# Altium schematic sheet Power.SchDoc
size A4
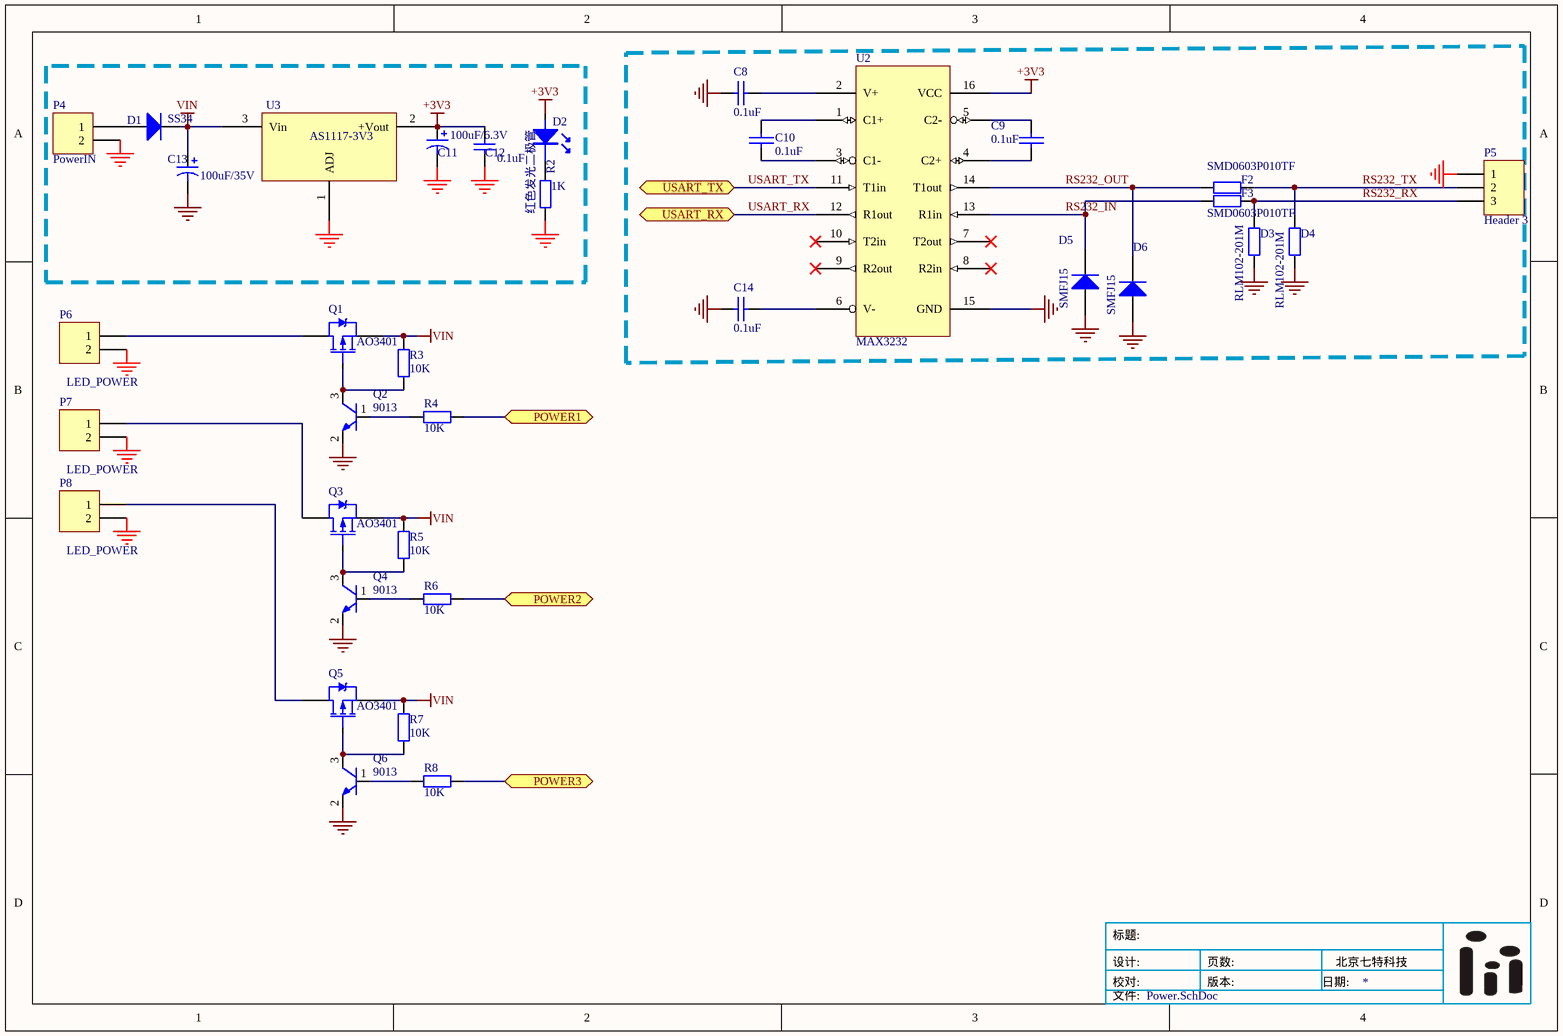
[diagram p0: Power.SchDoc]

## Parts
C8  0.1uF  [C2012]
C9  0.1uF  [C2012]
C10  0.1uF  [C2012]
C11  100uF/6.3V  [3216]
C12  0.1uF  [C2012]
C13  100uF/35V  [ECS6.3/6.6]
C14  0.1uF  [C2012]
D1  SS34  [SMA_DO-214AC]
D2  红色发光二极管  [LED/S]
D3  RLM102-201M  [RLM102]
D4  RLM102-201M  [RLM102]
D5  SMFJ15  [SOD-123]
D6  SMFJ15  [SOD-123]
F2  SMD0603P010TF  [1608]
F3  SMD0603P010TF  [1608]
P4  PowerIN  [5264-2]
P5  Header 3  [B3B-XH-A]
P6  LED_POWER  [B2B-XH-A]
P7  LED_POWER  [B2B-XH-A]
P8  LED_POWER  [B2B-XH-A]
Q1  AO3401  [SOT-23]
Q2  9013  [sot-23]
Q3  AO3401  [SOT-23]
Q4  9013  [sot-23]
Q5  AO3401  [SOT-23]
Q6  9013  [sot-23]
R2  1K  [2012]
R3  10K  [2012]
R4  10K  [2012]
R5  10K  [2012]
R6  10K  [2012]
R7  10K  [2012]
R8  10K  [2012]
U2  MAX3232  [SO16]
U3  AS1117-3V3  [SOT223_L]

## Ports
POWER1, POWER2, POWER3, USART_RX, USART_TX

## Nets
+3V3: C11.1 C12.2 D2.A U2.16(VCC) U3.2(+Vout)
GND: C8.1 C11.2 C12.1 C13.2 C14.2 D3.2 D4.2 D5.1(A) D6.1(A) P4.2 P5.1 P6.2 P7.2 P8.2 Q2.2(E) Q4.2(E) Q6.2(E) R2.2 U2.15(GND) U3.1(ADJ)
VIN: C13.1 D1.2(K) Q1.2(D) Q3.2(D) Q5.2(D) R3.2 R5.2 R7.2 U3.3(Vin)
POWER1: R4.1 ; port POWER1
POWER2: R6.1 ; port POWER2
POWER3: R8.1 ; port POWER3
RS232_IN: D5.2(K) F3.2 U2.13(R1in)
RS232_OUT: D6.2(K) F2.2 U2.14(T1out)
RS232_RX: D3.1 F3.1 P5.3
RS232_TX: D4.1 F2.1 P5.2
USART_RX: U2.12(R1out) ; port USART_RX
USART_TX: U2.11(T1in) ; port USART_TX
NetC8_2: C8.2 U2.2(V+)
NetC9_1: C9.1 U2.4(C2+)
NetC9_2: C9.2 U2.5(C2-)
NetC10_1: C10.1 U2.1(C1+)
NetC10_2: C10.2 U2.3(C1-)
NetC14_1: C14.1 U2.6(V-)
NetD1_1: D1.1(A) P4.1
NetD2_K: D2.K R2.1
NetP6_1: P6.1 Q1.3(S)
NetP7_1: P7.1 Q3.3(S)
NetP8_1: P8.1 Q5.3(S)
NetQ1_1: Q1.1(G) Q2.3(C) R3.1
NetQ2_1: Q2.1(B) R4.2
NetQ3_1: Q3.1(G) Q4.3(C) R5.1
NetQ4_1: Q4.1(B) R6.2
NetQ5_1: Q5.1(G) Q6.3(C) R7.1
NetQ6_1: Q6.1(B) R8.2

Not connected (* = marked no-connect by the designer): U2 7(T2out)* 8(R2in)* 9(R2out)* 10(T2in)*

## Notes on the sheet
- 标题:
- 设计:
- 校对:
- 页数:
- 版本:
- 日期:
- 北京七特科技
- 文件:

## Library data of the parts
C8-C10 C14 = CAP: Capacitor
C11 C13 = Cap Pol1: Polarized Capacitor (Radial); Published: 8-Jun-2000; LatestRevisionDate: 17-Jul-2002; LatestRevisionNote: Re-released for DXP Platform.; PackageReference: RB7.6-15; Publisher: Altium Limited
  C11: Value: 100uF/6.3V
  C13: PackageDescription: Polarized Capacitor (Radial); 2 Leads; Value: 100uF/35V
C12 = Cap: Capacitor; Published: 8-Jun-2000; LatestRevisionDate: 17-Jul-2002; LatestRevisionNote: Re-released for DXP Platform.; PackageReference: RAD-0.3; Publisher: Altium Limited; PackageDescription: Radial Cap, Thru-Hole; 2 Leads; 0.3 in Pin Spacing; Value: 0.1uF
D1 D5 D6 = Diode: Default Diode; Published: 8-Jun-2000; LatestRevisionDate: 17-Jul-2002; LatestRevisionNote: Re-released for DXP Platform.; PackageDocument: Sep-1996; PackageReference: SMC; Publisher: Altium Limited; Code_JEDEC: DO-214-AB
D2 = LED
D3 D4 F2 F3 = Res2: Resistor; Value: 5K6; Published: 8-Jun-2000; LatestRevisionDate: 17-Jul-2002; LatestRevisionNote: Re-released for DXP Platform.; PackageReference: 2012; Publisher: Altium Limited
P4 P6-P8 = Header 2: Header, 2-Pin; LatestRevisionDate: 17-Jul-2002; LatestRevisionNote: Re-released for DXP Platform.; Publisher: Altium Limited
P5 = Header 3: Header, 3-Pin; LatestRevisionDate: 17-Jul-2002; LatestRevisionNote: Re-released for DXP Platform.; Publisher: Altium Limited
Q1 Q3 Q5 = PMOS-2: P-Channel Power MOSFET; Note: Pin 4 not drawn and electrically connected to Pin 2.; Published: 8-Jun-2000; LatestRevisionDate: 17-Jul-2002; LatestRevisionNote: Re-released for DXP Platform.; DatasheetDocument: PD-9.390D; PackageReference: TO-220AB; Publisher: Altium Limited; Code_JEDEC: TO-220-AB; ComponentLink1Description: Manufacturer Link; ComponentLink1URL: http://www.irf.com/
Q2 Q4 Q6 = NPNBT
R2-R8 = Res2: Resistor; Published: 8-Jun-2000; LatestRevisionDate: 17-Jul-2002; LatestRevisionNote: Re-released for DXP Platform.; PackageReference: AXIAL-0.4; Publisher: Altium Limited
  R2: Value: 1K
  R3-R8: Value: 10K
U2 = ST3232: 3.3V/5V Dual RS232 Transceiver w/ Int. Cap.
U3 = LM117T